# Altium schematic sheet [1] Supply.SchDoc
size A4; DocumentNumber: 2; SheetNumber: 2; SheetTotal: 4
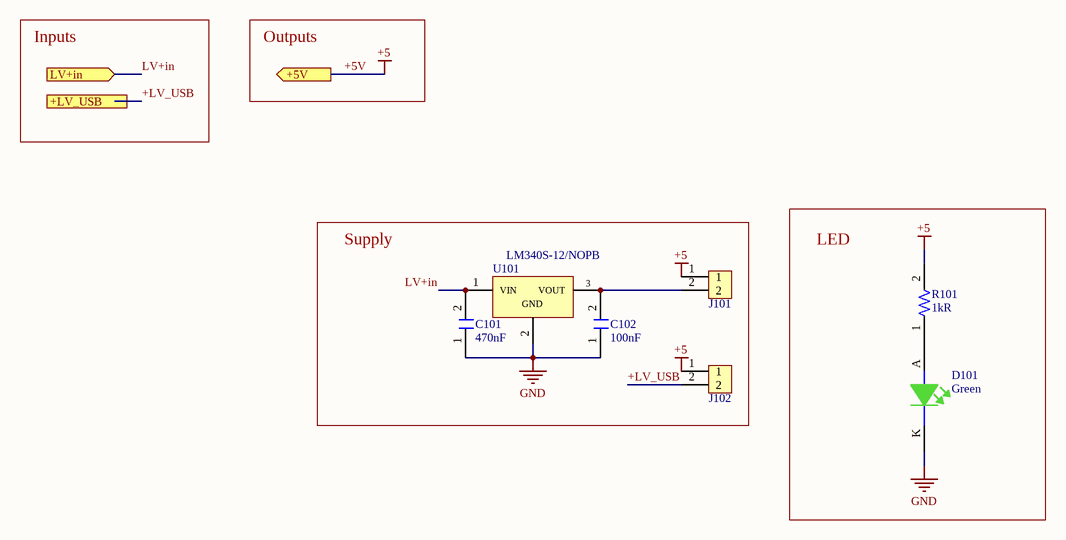
[diagram p0: [1] Supply.SchDoc]

## Parts
C101  Capacitance: 470nF  [C1206FNPC-RW]  (hidden comment: 885012208011)
C102  Capacitance: 100nF  [C1206FNPC-RW]  (hidden comment: 885012208058)
D101  Color: Green  [LED_1206_WE]  (hidden comment: 150120GS75000)
J101  61300211121  [J_Pinheader_1x2]  (value not drawn)
J102  61300211121  [J_Pinheader_1x2]  (value not drawn)
R101  Resistance: 1kR  [R1206FTK-W]  (hidden comment: ERJT08J102V)
U101  Manufacturer Part Number: LM340S-12/NOPB  [LDO_35V-1/12V-TO220]  (hidden comment: DO_35V-1/12V-TO220)

## Blocks framed on the sheet
Supply: C101 C102 J101 J102 U101
LED: D101 R101

## Ports
+5V (out, see AD_info[3B]), +LV_USB (in, see AD_info[3B]), LV+in (in, see AD_info[3B])

## Nets
+5V: J101.1 J102.1 R101.2 ; port +5V  [also labelled +5]
GND: C101.1 C102.1 D101.K U101.2(GND)
+LV_USB: J102.2 ; port +LV_USB
LV+in: C101.2 U101.1(VIN) ; port LV+in
NetC102_2: C102.2 J101.2 U101.3(VOUT)
NetD101_A: D101.A R101.1

## Notes on the sheet
- Inputs
- Outputs

## Library data of the parts
C101 = C470n-10V-1206FNPC-X7R: Cap, 0.47ΜF, 10V, 10%, X7R, 1206; Manufacturer 1: Wurth Electronics; .Creator: DO; Supplier 1: Digi-Key; Manufacturer Part Number 1: 885012208011; RoHS: Yes; Category: Ceramic Capacitors; Stock 1: 1142; Pricing 1: 1=0,20000, 10=0,17700, 100=0,15900, 500=0,14000 (USD); Mount: Surface Mount; Case/Package: 1206; Case Code (Metric): 3216; Case Code (Imperial): 1206; Min Operating Temperature: -55°C; Max Operating Temperature: 125°C; Packaging: Tape and Reel; Voltage Rating: 10V; Tolerance: 10%; Length: 0.126inch; Width: 0.063inch; Thickness: 0.051inch; RoHS Compliant: Yes; ComponentLink1URL: http://www.farnell.com/datasheets/2546926.pdf?src-supplier=Farnell; ComponentLink1Description: http://www.farnell.com/datasheets/2546926.pdf?src-supplier=Farnell; ComponentLink2URL: https://katalog.we-online.de/pbs/datasheet/885012208011.pdf?src-supplier=Digi-Key; ComponentLink2Description: https://katalog.we-online.de/pbs/datasheet/885012208011.pdf?src-supplier=Digi-Key; Supplier Part Number 1: 732-7683-1-ND; ComponentLink3Description: Wurth Elektronik; ComponentLink3URL: https://www.we-online.com/catalog/en/WCAP-CSGP-10VDC?sq=885012208011#885012208011
C102 = C100n-25V-1206FNPC-X7R: Cap Cer 0.1UF 25V X7R 1206; Manufacturer: Wurth Electronics; Tolerance: 10%; .Creator: DO; Category: Capacitor; ComponentLink1Description: Datasheet; ComponentLink1URL: https://www.we-online.com/catalog/datasheet/885012208058.pdf; ComponentLink2Description: Where buy it; ComponentLink2URL: https://www.we-online.com/catalog/en/WCAP-CSGP-25VDC#885012208058; Supplier 1: Digi-Key; Manufacturer Part Number: 885012208058; RoHS: Yes; Stock 1: 4375; Pricing 1: 1=0,11000, 10=0,10100, 100=0,09100, 500=0,08000 (USD); Mount: Surface Mount; Case/Package: 1206; Case Code (Metric): 3216; Case Code (Imperial): 1206; Min Operating Temperature: -55°C; Max Operating Temperature: 125°C; Packaging: Tape and Reel; Voltage Rating: 25V; Length: 0.126inch; Width: 0.063inch; Thickness: 0.035inch; RoHS Compliant: Yes; ComponentLink3URL: https://katalog.we-online.de/pbs/datasheet/885012208058.pdf?src-supplier=Digi-Key; ComponentLink3Description: https://katalog.we-online.de/pbs/datasheet/885012208058.pdf?src-supplier=Digi-Key; Supplier Part Number 1: 732-8109-1-ND
D101 = LEDGS-1206-450: Led, Green, 520 Nm, 3.2 V, 30 Ma, 450 Mcd Rohs Compliant: Yes; Manufacturer: Wurth Electronics; Wavelength: 520nm; Luminous Intensity: 450mcd; Viewing Angle: 140°; Forward Current: 30mA; Lens Style: Clear,Rectangular; Test Current: 20mA; Forward Voltage: 3.2V; .Creator: GP; Supplier 1: RSComponents; RoHS: Yes; Category: LEDs; Stock 1: 1; Pricing 1: 50=0,23200, 500=0,16400, 750=0,15500, 1500=0,15000, 3000=0,14200 (USD); Mount: Surface Mount; Case/Package: 1206; Case Code (Metric): 3216; Case Code (Imperial): 1206; Min Operating Temperature: -40°C; Max Operating Temperature: 85°C; Package Quantity: 3000; Packaging: Tape and Reel; Dominant Wavelength: 520nm; Length: 3.2mm; Width: 1.6mm; Height: 0.68mm; REACH SVHC: Unknown; RoHS Compliant: Yes; ComponentLink1URL: https://datasheet.ciiva.com/22656/150120gs75000-22656979.pdf?src-supplier=Element14; ComponentLink1Description: https://datasheet.ciiva.com/22656/150120gs75000-22656979.pdf?src-supplier=Element14; ComponentLink2URL: https://datasheet.ciiva.com/29279/759441-da-01-en-chipled-1206-w-kl-gruen-150120gs75000-29279042.pdf?src-supplier=Conrad; ComponentLink2Description: https://datasheet.ciiva.com/29279/759441-da-01-en-chipled-1206-w-kl-gruen-150120gs75000-29279042.pdf?src-supplier=Conrad; ComponentLink3URL: https://datasheet.ciiva.com/48430/150120gs75000-eng-tds-48430053.pdf?src-supplier=Distrelec; ComponentLink3Description: https://datasheet.ciiva.com/48430/150120gs75000-eng-tds-48430053.pdf?src-supplier=Distrelec; ComponentLink4URL: https://datasheet.ciiva.com/29561/150120gs75000-29561883.pdf?src-supplier=Digi-Key; ComponentLink4Description: https://datasheet.ciiva.com/29561/150120gs75000-29561883.pdf?src-supplier=Digi-Key; ComponentLink5URL: https://datasheet.ciiva.com/29561/150120gs75000-29561884.pdf?src-supplier=Digi-Key; ComponentLink5Description: https://datasheet.ciiva.com/29561/150120gs75000-29561884.pdf?src-supplier=Digi-Key; ComponentLink6URL: https://datasheet.ciiva.com/29561/150120gs75000-29561885.pdf?src-supplier=Digi-Key; ComponentLink6Description: https://datasheet.ciiva.com/29561/150120gs75000-29561885.pdf?src-supplier=Digi-Key; Supplier Part Number 1: 8154247P; Manufacturer Part Number: 150120GS75000; ComponentLink7Description: Where buy it; ComponentLink7URL: https://www.we-online.com/catalog/en/WL-SMCW?sq=150120GS75000#150120GS75000
J101 J102 = J_Jumper: CONN HEADER 2 POS 2.54; Manufacturer: Molex; Temperature rating: -40° to +105°C; Category type: PCB-PCB; Product name: Pin Header; Maximum current: 3 A; Maximum voltage: 250 V AC; Connections: 1x2; Current Rating: 3A; Voltage Rating: 250V; Number of Positions: 2; Gender: Male; Connector Type: Male Pin; Pitch: 0.1inch; .Creator: GP; Category: Connector; ComponentLink1Description: Datasheet; ComponentLink1URL: https://www.we-online.com/catalog/datasheet/61300211121.pdf; ComponentLink2Description: Where buy it; ComponentLink2URL: https://www.we-online.com/catalog/en/PHD_2_54_THT_PIN_HEADER_6130XX11121?sq=61300211121&sp=https%3A%2F%2Fwww.we-online.com%2Fweb%2Fen%2Fwuerth_elektronik%2Fsearchpage.php%3Fsearch%3D61300211121#61300211121; Manufacturer part number: 61300211121; Supplier: Würth Elektronik; RoHS: *; Application: Shortcircuit; Flammability: 94V-0; Orientation: Vertical; Mount: Through hole; Supplier 1: RSComponents; Stock 1: 1855; Pricing 1: 5=0,14100, 50=0,09700, 100=0,07800, 200=0,07300, 500=0,06800 (USD); Contact Plating: Gold; Housing Material: PBT; Contact Material: Copper Alloy,Copper; Color: Black; Min Operating Temperature: -40°C; Max Operating Temperature: 125°C; Number of Rows: 1; Contact Gender: Male; Packaging: Bulk; Termination: Through Hole; Number of Contacts: 2; Contact Mating Length: 0.236inch; REACH SVHC: Unknown; Lead Free: Lead Free; ComponentLink3URL: https://datasheet.ciiva.com/13619/6130xx11121-48870-13619345.pdf?src-supplier=Mouser; ComponentLink3Description: https://datasheet.ciiva.com/13619/6130xx11121-48870-13619345.pdf?src-supplier=Mouser; Supplier Part Number 1: 8281581
R101 = R1k-1206FTK: Res Thick Film 1206 1K Ohm 5% 0.33W(1/3W) ±200ppm/C Pad SMD Automotive T/R; Manufacturer: Panasonic; Temperature Coefficient: 200ppm/°C; Power Rating: 330mW; Voltage Rating: 200V; Max Power Dissipation: 333mW; .Creator: GP; Category: Resistor; ComponentLink1Description: Datasheet; ComponentLink1URL: https://docs.rs-online.com/ef78/0900766b812cb812.pdf; ComponentLink2Description: Where buy it; ComponentLink2URL: https://es.rs-online.com/web/p/resistencias-de-montaje-en-superficie/7218936; Supplier 1: RSComponents; Manufacturer Part Number: ERJT08J102V; RoHS: Yes; Stock 1: 1; Pricing 1: 5=0,32200, 50=0,30000, 100=0,28100, 250=0,25900, 500=0,23800 (USD); Mount: Surface Mount; Case/Package: 1206; Number of Pins: 2; Contact Plating: Tin; Case Code (Metric): 3216; Case Code (Imperial): 1206; Min Operating Temperature: -55°C; Max Operating Temperature: 155°C; Tolerance: 5%; Resistor Type: Thick Film; Package Quantity: 5000; Packaging: Tape and Reel; Number of Terminations: 2; Voltage Rating (DC): 200V; Termination: Tab; Features: Automotive AEC-Q200; Length: 3.2mm; Width: 0.063inch; Height: 0.6mm; Depth: 1.6mm; Radiation Hardening: No; REACH SVHC: No SVHC; Military Standard: Not; RoHS Compliant: Yes; Supplier Part Number 1: 7218936
U101 = CMP-00147-1: 1.5-A, 35-V, linear voltage regulator 3-TO-220 -40 to 125; Manufacturer: Texas Instruments; Output Voltage: 12V; Quiescent Current: 8mA; Output Type: Fixed; Dropout Voltage: 2V; Accuracy: 2%; Output Current: 1A; .Creator: AC; Number of Outputs: 1; Polarity: Positive; Max Input Voltage: 35V; Mount: Through Hole; Package Quantity: 45; Width: 4.7mm; RoHS: Yes; ComponentLink1URL: https://datasheet.ciiva.com/16490/lm340-n-16490133.pdf?src-supplier=Avnet+Asia; Min Operating Temperature: -40°C; Number of Pins: 3; RoHS Compliant: Yes; ComponentLink2URL: https://es.rs-online.com/web/p/reguladores-de-tension/1977323; Max Operating Temperature: 125°C; Design Item ID: LDO_35V-1/12V-TO220; Source: Semiconductor.SchLib; ComponentLink2Description: Where buy it; Length: 10.16mm; Category: Voltage Regulators - Linear; Pricing 1: 1=1,97000, 10=1,76700, 25=1,66680, 100=1,42020, 250=1,33348, 500=1,16680, 1000=1,10075 (USD); Lead Free: Lead Free; ComponentLink1Description: https://datasheet.ciiva.com/16490/lm340-n-16490133.pdf?src-supplier=Avnet+Asia; Height: 8.89mm; Packaging: Rail/Tube; Radiation Hardening: No; Series: LM340-N; Max Output Current: 1A; Voltage: 12V; Case/Package: TO-220; Output Voltage Accuracy: 2%